# EAGLE design ORG1510-MK4 breakout (EAGLE 8.5.0)
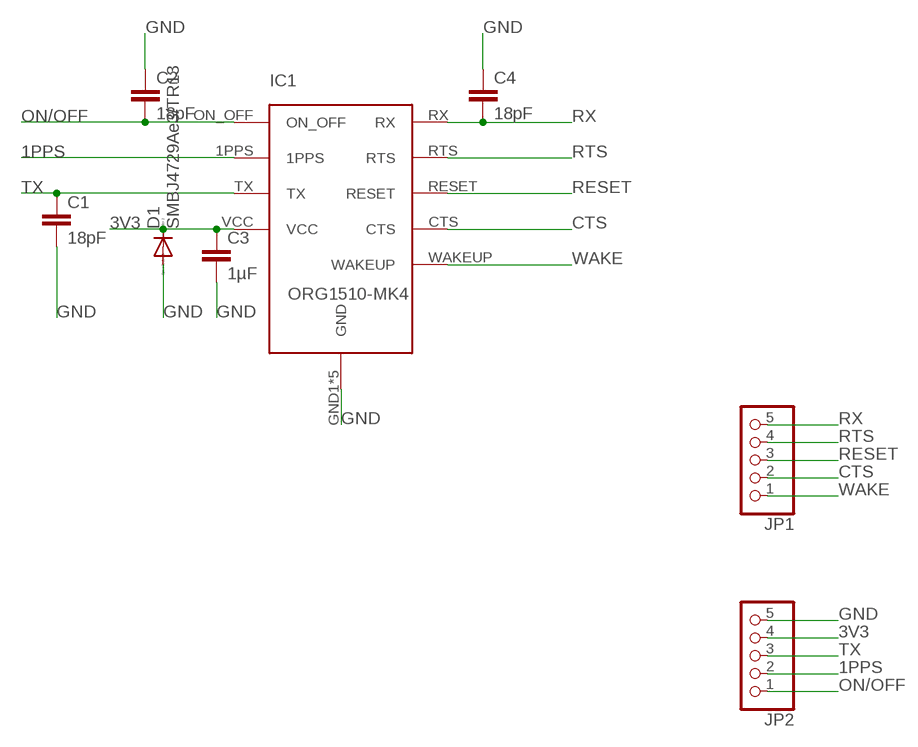
[diagram p0: schematic, sheet 1]

## Parts
C1  18pF  C-EUC0805  [C0805]
C2  18pF  C-EUC0805  [C0805]
C3  1µF  C-EUC0805  [C0805]
C4  18pF  C-EUC0805  [C0805]
D1  SMBJ4729Ae3/TR13  DIODE-DO214AA  [DO214AA]
IC1  ORG1510-MK4  [PACKAGE]
JP1  PINHD-1X5  [1X05]
JP2  PINHD-1X5  [1X05]

## Nets
1PPS: IC1.1PPS JP2.2
3V3: C3.1 D1.C IC1.VCC JP2.4
CTS: IC1.CTS JP1.2
GND: C1.2 C2.1 C3.2 C4.1 D1.A IC1.GND1(GND) IC1.GND2(GND) IC1.GND3(GND) IC1.GND4(GND) IC1.GND5(GND) JP2.5
ON/OFF: C2.2 IC1.ON_OFF JP2.1
RESET: IC1.RESET JP1.3
RTS: IC1.RTS JP1.4
RX: C4.2 IC1.RX JP1.5
TX: C1.1 IC1.TX JP2.3
WAKE: IC1.WAKEUP JP1.1

## Library data of the parts
C1-C4 = resistor:C-EU: CAPACITOR, European symbol
D1 = diode:DIODE-: DIODE
IC1 = ORG1510-MK4 GPS module:ORG1510-MK4
JP1 JP2 = pinhead:PINHD-1X5: PIN HEADER

## Board
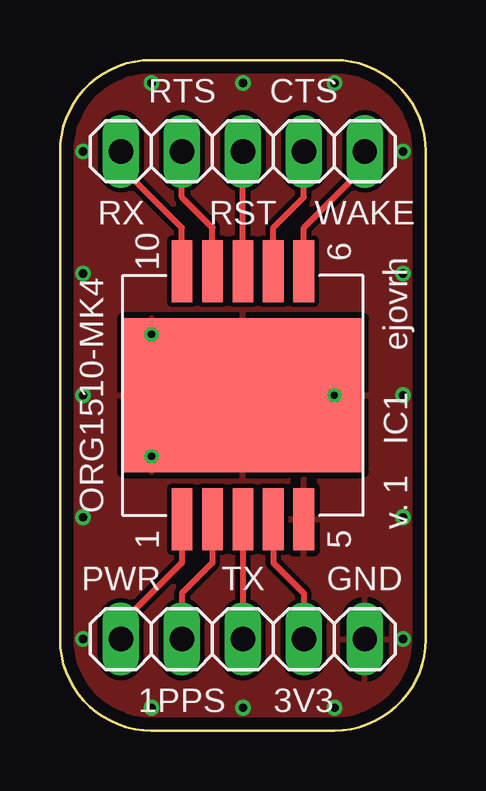
[diagram p1: board, top side]
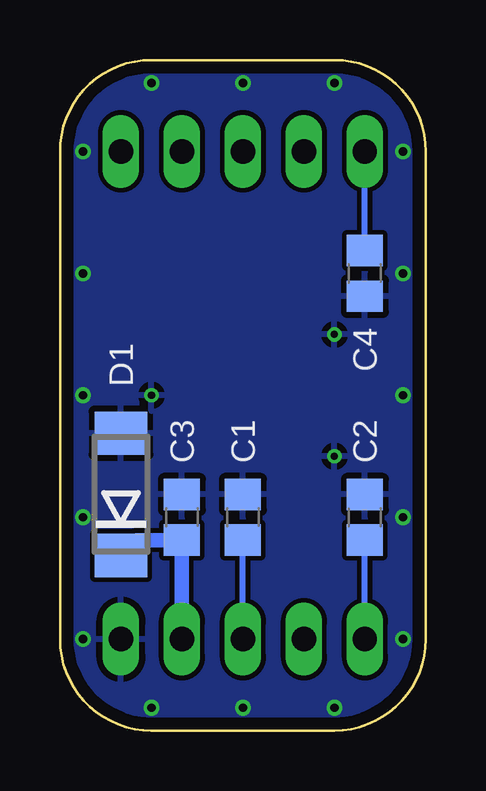
[diagram p2: board, bottom side, seen from below]

Size 15.24 x 27.94 mm. Coordinates in mm from the lower left corner, seen from the top.
Outline: 3.81,0 11.43,0 arc90 15.24,3.81 15.24,24.13 arc90 11.43,27.94 3.81,27.94 arc90 0,24.13 0,3.81 arc90 3.81,0
Copper layers (1*16): Top 0.035mm / dielectric 1.5mm / Bottom 0.035mm
Design rules "markovac_2layer": minimum track width 0.2mm, minimum drill 0.3mm, track to track 0.2mm, track to pad 0.2mm, pad to pad 0.2mm, via to via 0.2mm, smd to smd 0.2mm, copper to edge 0.5mm, drill to drill 8mil, minimum pad ring 0.15mm, minimum via ring 0.15mm, stop-mask expansion 4mil, vias tented up to drill 25mil, thermal gap 10mil

### Footprints (pad centres in the part's own frame; a part is rotated, then mirrored left to right if it is on the bottom)
C0805 = smd 1.3 x 1.5: 1 -0.95,0; 2 0.95,0
DO214AA = smd 1.8 x 2.2: A 2.55,0; C -2.55,0
PACKAGE = smd 2.591 x 0.864: 1PPS 5.168,-1.27; CTS -5.168,1.27; GND3 5.168,2.54; ON_OFF 5.168,-2.54; RESET -5.168,0; RTS -5.168,-1.27; RX -5.168,-2.54; TX 5.168,0; VCC 5.168,1.27; WAKEUP -5.168,2.54 | drill 0.3: GND1 -2.54,-3.81; GND4 0,3.81; GND5 2.54,-3.81 | smd 6.4 x 10: GND2 0,0
1X05 = drill 1.016 long: 1 -5.08,0; 2 -2.54,0; 3 0,0; 4 2.54,0; 5 5.08,0

### Placement (x,y rotation side)
C1  7.62,8.89 90 bottom
C2  2.54,8.89 270 bottom
C3  10.16,8.89 90 bottom
C4  2.54,19.05 90 bottom
D1  12.7,9.84 90 bottom
IC1  7.62,13.97 270 top
JP1  7.62,24.13 180 top
JP2  7.62,3.81 0 top

### Tracks (layer width: path | path; a pad name or v marks a point on that pad's centre or on a via)
1PPS
  Top 0.25: IC1.1PPS 6.35,6.98 5.08,5.71 JP2.2
3V3
  Top 0.25: IC1.VCC 8.89,6.98 10.16,5.71 JP2.4
  Bottom 0.6: JP2.4 C3.1 12.05,7.94 D1.C
CTS
  Top 0.25: IC1.CTS 8.89,20.95 10.16,22.22 JP1.2
GND  (via drill 0.35)
  other vias: 3.81,26.99 11.43,26.99 0.95,24.13 14.29,24.13 0.95,3.81 3.81,0.95 11.43,0.95 14.29,3.81 7.62,0.95 7.62,26.99 0.95,13.97 14.29,13.97 0.95,8.89 14.29,8.89 0.95,19.05 14.29,19.05
  pour Bottom: 0,27.94 15.24,27.94 15.24,0 0,0
  pour Top: 0,27.94 15.24,27.94 15.24,0 0,0
ON/OFF
  Top 0.25: JP2.1 2.54,4.45 5.08,6.98 IC1.ON_OFF
  Bottom 0.25: JP2.1 C2.2
RESET
  Top 0.25: IC1.RESET JP1.3
RTS
  Top 0.25: IC1.RTS 6.35,20.95 5.08,22.22 JP1.4
RX
  Top 0.25: IC1.RX 5.08,20.95 2.54,23.5 JP1.5
  Bottom 0.25: C4.2 JP1.5
TX
  Top 0.25: IC1.TX JP2.3
  Bottom 0.25: JP2.3 C1.1
WAKE
  Top 0.25: IC1.WAKEUP 10.16,20.95 12.7,23.5 JP1.1

### Text on the board
tPlace: RTS | CTS | RX | RST | WAKE | ejovrh | v. 1 | PWR | TX | GND | 1PPS | 3V3